# EAGLE design scheme (EAGLE 6.4)
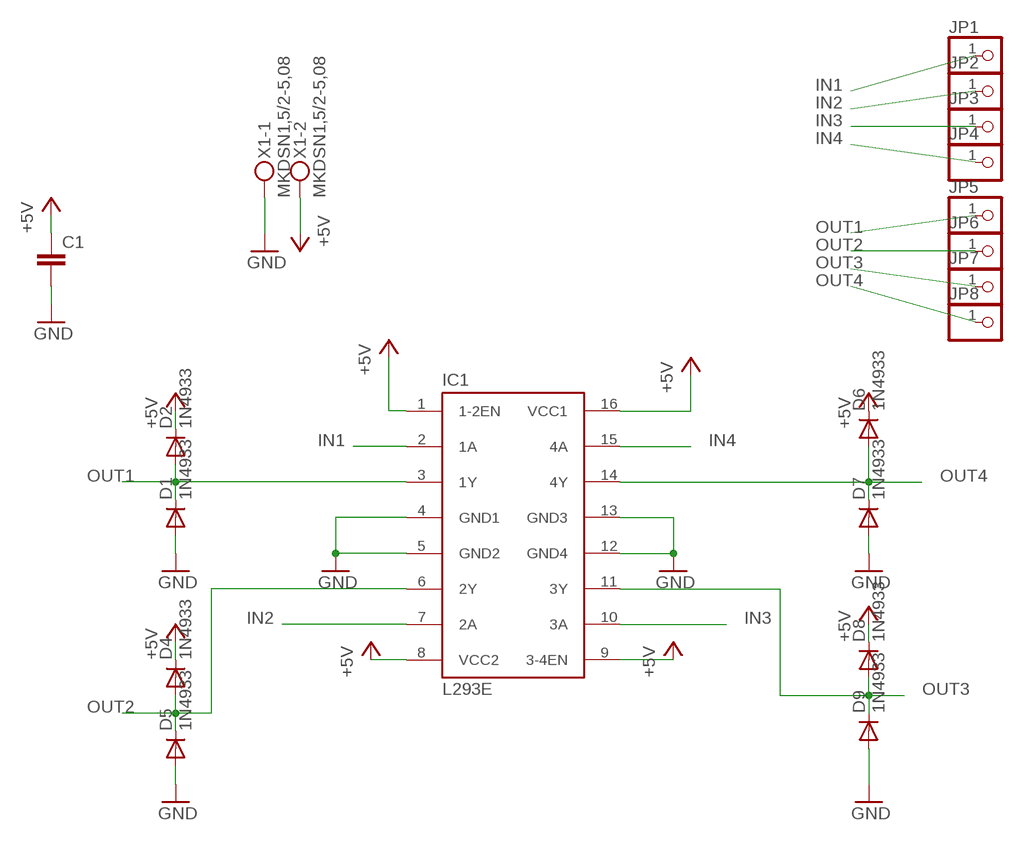
[diagram p0: schematic, sheet 1]

## Parts
C1  C-EUC0805K  [C0805K]
D1  1N4933  [DO41-10]
D2  1N4933  [DO41-10]
D4  1N4933  [DO41-10]
D5  1N4933  [DO41-10]
D6  1N4933  [DO41-10]
D7  1N4933  [DO41-10]
D8  1N4933  [DO41-10]
D9  1N4933  [DO41-10]
IC1  L293E  [DIL16]
JP1  PINHD-1X1  [1X01]
JP2  PINHD-1X1  [1X01]
JP3  PINHD-1X1  [1X01]
JP4  PINHD-1X1  [1X01]
JP5  PINHD-1X1  [1X01]
JP6  PINHD-1X1  [1X01]
JP7  PINHD-1X1  [1X01]
JP8  PINHD-1X1  [1X01]
X1  MKDSN1,5/2-5,08  [MKDSN1,5/2-5,08]

## Nets
+5V: C1.1 D2.C D4.C D6.C D8.C IC1.1(1-2EN) IC1.8(VCC2) IC1.9(3-4EN) IC1.16(VCC1) X1.2
GND: C1.2 D1.A D5.A D7.A D9.A IC1.4(GND1) IC1.5(GND2) IC1.12(GND4) IC1.13(GND3) X1.1
IN1: IC1.2(1A) JP1.1
IN2: IC1.7(2A) JP2.1
IN3: IC1.10(3A) JP3.1
IN4: IC1.15(4A) JP4.1
OUT1: D1.C D2.A IC1.3(1Y) JP5.1
OUT2: D4.A D5.C IC1.6(2Y) JP6.1
OUT3: D8.A D9.C IC1.11(3Y) JP7.1
OUT4: D6.A D7.C IC1.14(4Y) JP8.1

## Library data of the parts
C1 = resistor:C-EU: CAPACITOR, European symbol
D1 D2 D4-D9 = diode:1N4933: DIODE fast recovery rectifier, 1A
IC1 = texas:L293E: TI DEVICE; MF: Arrow Electronics; MPN: L293E; OC_FARNELL: 1467711; OC_NEWARK: 89K0732
JP1-JP8 = pinhead:PINHD-1X1: PIN HEADER
X1 = con-phoenix-508:MKDSN1,5/2-5,08: MKDSN 1,5/ 2-5,08 Printklemme Nennstrom: 13,5 A Nennspannung: 250 V Rastermaß: 5,08 mm Polzahl: 2 Anschlussart: Schraubanschluss Montage: Löten Anschlussrichtung Leiter/Platine: 0 ° Artikelnummer: 1729128 Source: http://eshop.phoenixcontact.com .. 1729128.pdf; MPN: MKDSN 1,5/2-5.08; OC_FARNELL: 1792903; OC_NEWARK: 30M2397

## Board
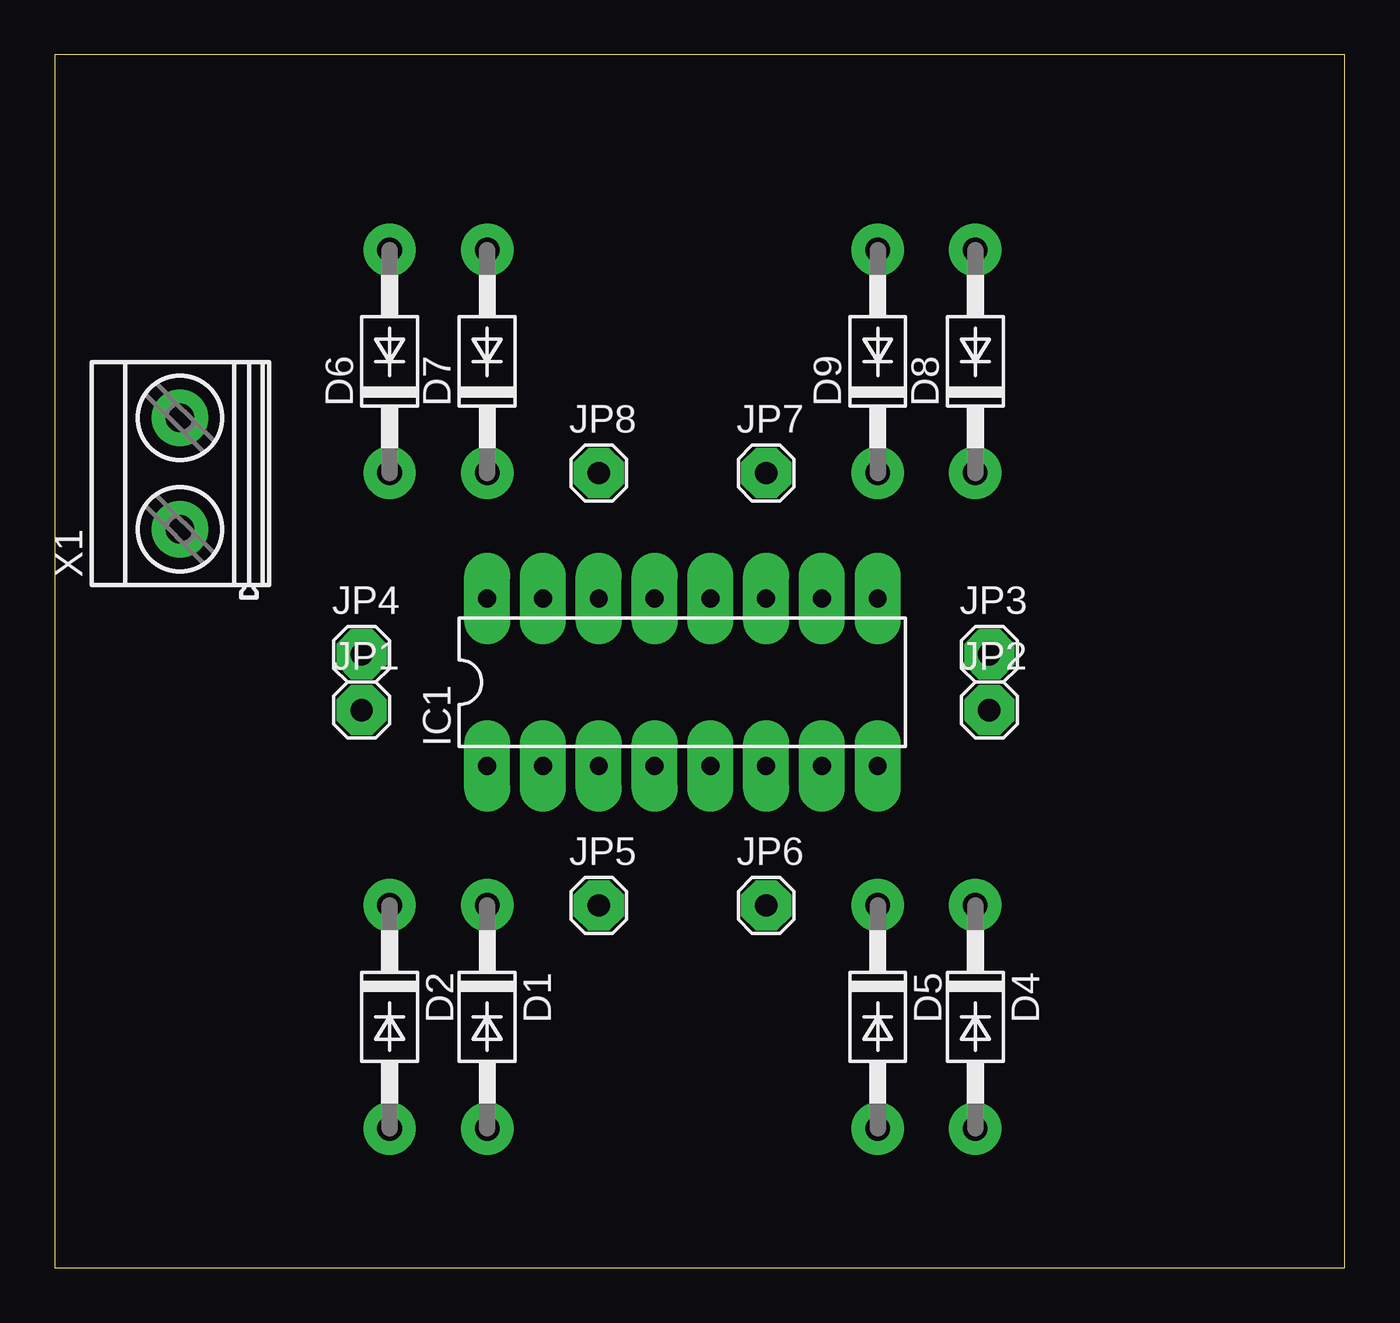
[diagram p1: board, top side]
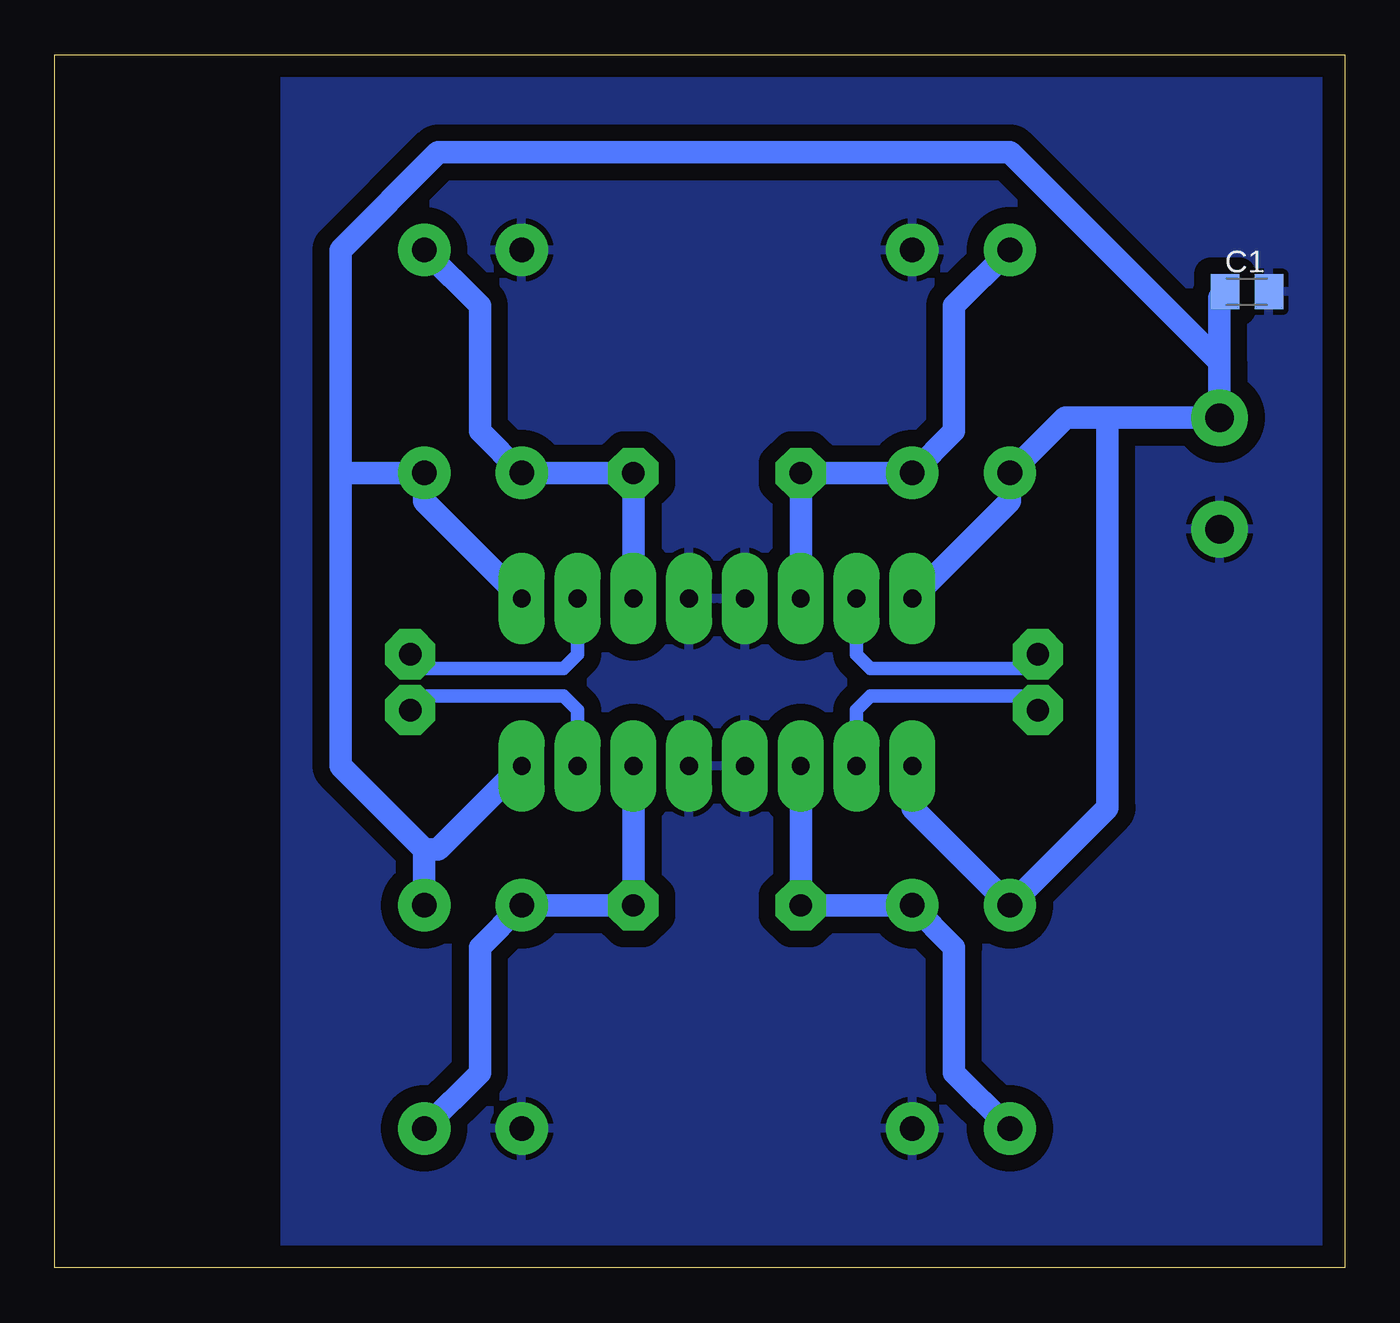
[diagram p2: board, bottom side, seen from below]

Size 58.73 x 55.23 mm. Coordinates in mm from the lower left corner, seen from the top.
Outline: 0,0 58.73,0 58.73,55.23 0,55.23 0,0
Copper layers (1*16): Top 0.035mm / dielectric 1.5mm / Bottom 0.035mm
Design rules "default": minimum track width 10mil, minimum drill 32mil, track to track 12mil, track to pad 12mil, pad to pad 12mil, via to via 12mil, smd to smd 8mil, copper to edge 40mil, drill to drill 40mil, minimum pad ring 25mil, minimum via ring 12mil, stop-mask expansion 4mil, vias tented up to drill 0mil, thermal gap 10mil

### Footprints (pad centres in the part's own frame; a part is rotated, then mirrored left to right if it is on the bottom)
C0805K = smd 1.3 x 1.6: 1 -1,0; 2 1,0
DO41-10 = drill 1.118: A 5.08,0; C -5.08,0
DIL16 = drill 0.813 long: 1 -8.89,-3.81; 2 -6.35,-3.81; 3 -3.81,-3.81; 4 -1.27,-3.81; 5 1.27,-3.81; 6 3.81,-3.81; 7 6.35,-3.81; 8 8.89,-3.81; 9 8.89,3.81; 10 6.35,3.81; 11 3.81,3.81; 12 1.27,3.81; 13 -1.27,3.81; 14 -3.81,3.81; 15 -6.35,3.81; 16 -8.89,3.81
1X01 = drill 1.016 octagon: 1 0,0
MKDSN1,5/2-5,08 = drill 1.3 pad 2: 1 -2.561,0.025; 2 2.519,0.025

### Placement (x,y rotation side)
C1  4.45,44.45 0 bottom
D1  19.68,11.43 270 top
D2  15.24,11.43 270 top
D4  41.91,11.43 270 top
D5  37.47,11.43 270 top
D6  15.24,41.27 90 top
D7  19.68,41.27 90 top
D8  41.91,41.27 90 top
D9  37.47,41.27 90 top
IC1  28.57,26.67 0 top
JP1  13.97,25.4 0 top
JP2  42.55,25.4 0 top
JP3  42.55,27.94 0 top
JP4  13.97,27.94 0 top
JP5  24.77,16.51 0 top
JP6  32.38,16.51 0 top
JP7  32.38,36.2 0 top
JP8  24.77,36.2 0 top
X1  5.71,36.2 90 top

### Tracks (layer width: path | path; a pad name or v marks a point on that pad's centre or on a via)
+5V
  Bottom 1.016: IC1.16 15.24,34.92 D6.C 12.72,38.71 10.79,38.71 | 10.79,38.71 X1.2 5.71,38.74 5.71,41.27 | 10.79,38.71 10.79,20.95 D2.C 19.68,20.95 IC1.1 | 5.71,41.27 15.24,50.8 41.27,50.8 45.72,46.35 45.72,36.2 | D4.C 41.91,19.05 | 41.91,19.05 45.72,22.86 45.72,36.2 | 41.91,19.05 41.27,19.05 IC1.8 | 45.72,36.2 D8.C 41.91,34.92 IC1.9 | 5.71,41.27 5.71,44.18 C1.1
GND
  pour Bottom (isolate 0.762): -3.17,56.52 48.26,56.52 48.26,-1.91 -3.17,-1.91
IN1
  Bottom 0.61: JP1.1 14.61,26.04 21.59,26.04 22.23,25.4 IC1.2
IN2
  Bottom 0.61: JP2.1 41.91,26.04 35.56,26.04 34.92,25.4 IC1.7
IN3
  Bottom 0.61: JP3.1 41.91,27.3 35.56,27.3 34.92,27.94 IC1.10
IN4
  Bottom 0.61: JP4.1 14.61,27.3 21.59,27.3 22.23,27.94 IC1.15
OUT1
  Bottom 1.016: D2.A 17.78,8.89 17.78,14.61 D1.C JP5.1 IC1.3
OUT2
  Bottom 1.016: D4.A 39.37,8.89 39.37,14.61 D5.C JP6.1 IC1.6
OUT3
  Bottom 1.016: IC1.11 JP7.1 D9.C 39.37,38.1 39.37,43.81 D8.A
OUT4
  Bottom 1.016: D6.A 17.78,43.81 17.78,38.1 D7.C JP8.1 IC1.14